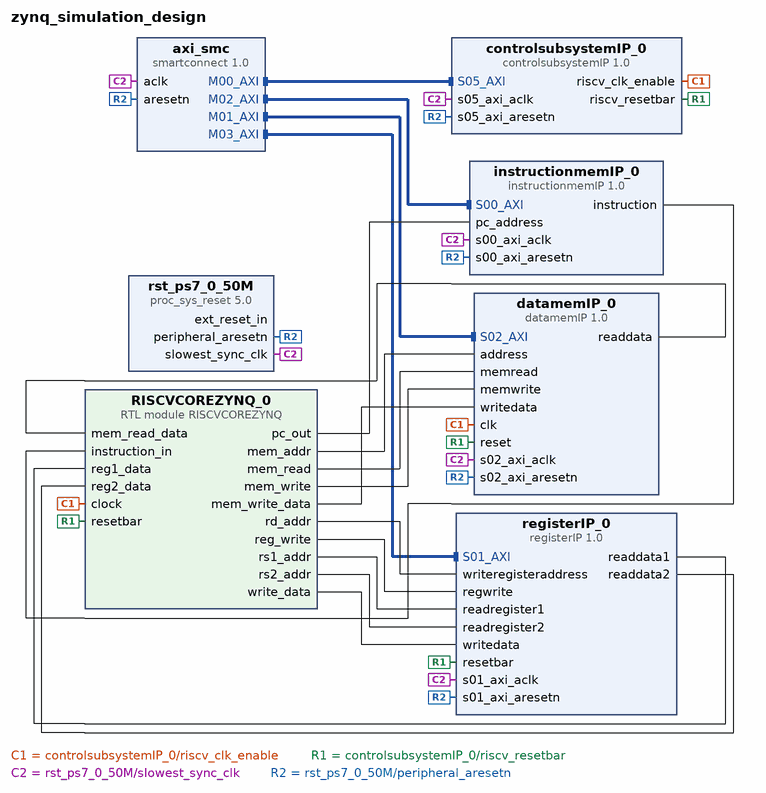
[diagram p0: block diagram of the top level]
# Vivado block design zynq_simulation_design, xc7z007sclg225-1, Vivado 2024.2
create_bd_design zynq_simulation_design

create_bd_cell -type module -reference RISCVCOREZYNQ RISCVCOREZYNQ_0
create_bd_cell -type ip -vlnv xilinx.com:ip:smartconnect:1.0 axi_smc
set_property -dict {CONFIG.NUM_MI 4 CONFIG.NUM_SI 1} [get_bd_cells axi_smc]
create_bd_cell -type ip -vlnv xilinx.com:user:controlsubsystemIP:1.0 controlsubsystemIP_0
create_bd_cell -type ip -vlnv xilinx.com:user:datamemIP:1.0 datamemIP_0
create_bd_cell -type ip -vlnv xilinx.com:user:instructionmemIP:1.0 instructionmemIP_0
create_bd_cell -type ip -vlnv xilinx.com:user:registerIP:1.0 registerIP_0
create_bd_cell -type ip -vlnv xilinx.com:ip:proc_sys_reset:5.0 rst_ps7_0_50M

# ---- connections ----

connect_bd_intf_net [get_bd_intf_pins axi_smc/M00_AXI] [get_bd_intf_pins controlsubsystemIP_0/S05_AXI]
connect_bd_intf_net [get_bd_intf_pins axi_smc/M01_AXI] [get_bd_intf_pins datamemIP_0/S02_AXI]
connect_bd_intf_net [get_bd_intf_pins axi_smc/M02_AXI] [get_bd_intf_pins instructionmemIP_0/S00_AXI]
connect_bd_intf_net [get_bd_intf_pins axi_smc/M03_AXI] [get_bd_intf_pins registerIP_0/S01_AXI]
connect_bd_net [get_bd_pins RISCVCOREZYNQ_0/mem_addr] [get_bd_pins datamemIP_0/address]
connect_bd_net [get_bd_pins RISCVCOREZYNQ_0/mem_read] [get_bd_pins datamemIP_0/memread]
connect_bd_net [get_bd_pins RISCVCOREZYNQ_0/mem_write] [get_bd_pins datamemIP_0/memwrite]
connect_bd_net [get_bd_pins RISCVCOREZYNQ_0/mem_write_data] [get_bd_pins datamemIP_0/writedata]
connect_bd_net [get_bd_pins RISCVCOREZYNQ_0/pc_out] [get_bd_pins instructionmemIP_0/pc_address]
connect_bd_net [get_bd_pins RISCVCOREZYNQ_0/rd_addr] [get_bd_pins registerIP_0/writeregisteraddress]
connect_bd_net [get_bd_pins RISCVCOREZYNQ_0/reg_write] [get_bd_pins registerIP_0/regwrite]
connect_bd_net [get_bd_pins RISCVCOREZYNQ_0/rs1_addr] [get_bd_pins registerIP_0/readregister1]
connect_bd_net [get_bd_pins RISCVCOREZYNQ_0/rs2_addr] [get_bd_pins registerIP_0/readregister2]
connect_bd_net [get_bd_pins RISCVCOREZYNQ_0/write_data] [get_bd_pins registerIP_0/writedata]
connect_bd_net [get_bd_pins controlsubsystemIP_0/riscv_clk_enable] [get_bd_pins RISCVCOREZYNQ_0/clock] [get_bd_pins datamemIP_0/clk]
connect_bd_net [get_bd_pins controlsubsystemIP_0/riscv_resetbar] \
  [get_bd_pins RISCVCOREZYNQ_0/resetbar] [get_bd_pins registerIP_0/resetbar] [get_bd_pins datamemIP_0/reset]
connect_bd_net [get_bd_pins datamemIP_0/readdata] [get_bd_pins RISCVCOREZYNQ_0/mem_read_data]
connect_bd_net [get_bd_pins instructionmemIP_0/instruction] [get_bd_pins RISCVCOREZYNQ_0/instruction_in]
connect_bd_net -net processing_system7_0_FCLK_CLK0 [get_bd_pins rst_ps7_0_50M/slowest_sync_clk] \
  [get_bd_pins axi_smc/aclk] [get_bd_pins controlsubsystemIP_0/s05_axi_aclk] [get_bd_pins registerIP_0/s01_axi_aclk] \
  [get_bd_pins datamemIP_0/s02_axi_aclk] [get_bd_pins instructionmemIP_0/s00_axi_aclk]
# net processing_system7_0_FCLK_RESET0_N has one end: rst_ps7_0_50M/ext_reset_in
connect_bd_net [get_bd_pins registerIP_0/readdata1] [get_bd_pins RISCVCOREZYNQ_0/reg1_data]
connect_bd_net [get_bd_pins registerIP_0/readdata2] [get_bd_pins RISCVCOREZYNQ_0/reg2_data]
connect_bd_net [get_bd_pins rst_ps7_0_50M/peripheral_aresetn] \
  [get_bd_pins axi_smc/aresetn] [get_bd_pins controlsubsystemIP_0/s05_axi_aresetn] [get_bd_pins registerIP_0/s01_axi_aresetn] \
  [get_bd_pins datamemIP_0/s02_axi_aresetn] [get_bd_pins instructionmemIP_0/s00_axi_aresetn]

validate_bd_design
save_bd_design
